# Altium project TP2_vchesnea.PrjPcb
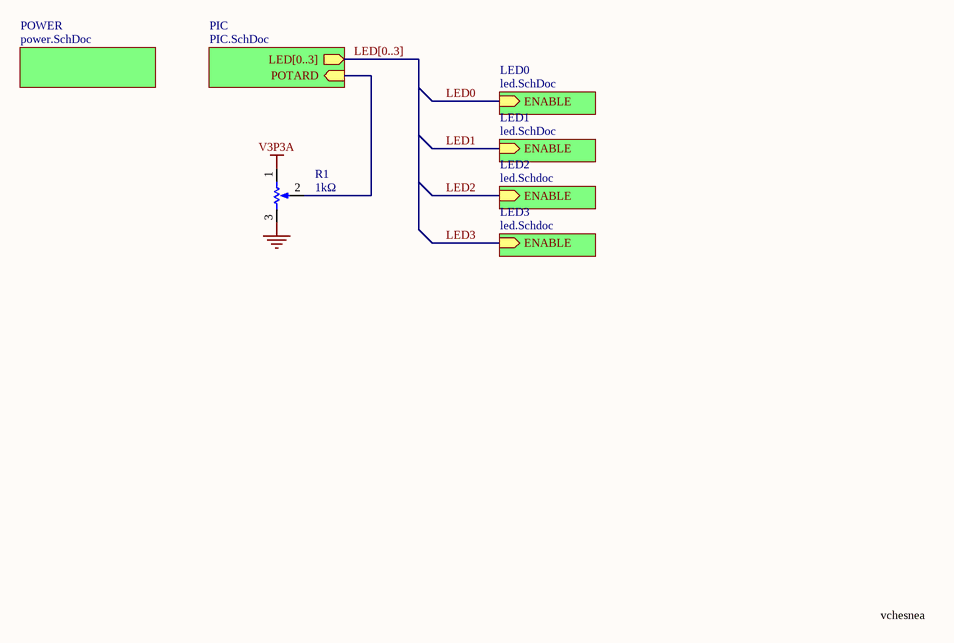
[diagram p0: TP2.SchDoc]
4 sheets, 36 parts. Net scope: hierarchical (ports join the sheet entries above them; power ports are global).
Sheets:
  TP2.SchDoc
    POWER = power.SchDoc
    PIC = PIC.SchDoc
    LED0 = led.SchDoc
    LED1 = led.SchDoc
    LED2 = led.SchDoc
    LED3 = led.SchDoc

## Sheet TP2.SchDoc
size A4

### Parts
R1  1kΩ  [PDB181-K415K-102A2]

### Sub-sheets
LED0 = led.SchDoc: ENABLE (in)
LED1 = led.SchDoc: ENABLE (in)
LED2 = led.Schdoc: ENABLE (in)
LED3 = led.Schdoc: ENABLE (in)
PIC = PIC.SchDoc: POTARD (in), LED[0..3] (out)
POWER = power.SchDoc: no entries

### Nets
+12: R1.3(TOP)
V3P3A: R1.1(BOT)
NetR1_2: R1.2(TAP) ; sheet PIC/POTARD

### Buses and harness runs
bus LED[0..3] = sheet PIC/LED[0..3]

### Notes on the sheet
- vchesnea
- Title
- Size:
- Date:
- A4
- Number:
- Time:
- Revision:
- Sheet
- of
- File:

### Library data of the parts
R1 = RPot: Potentiometer; Sim Note: Enter the Resistance value and the set point into parameter fields.; Set Position: 0.5; Value: 1K; Fournisseur: Farnell; Fabricant: BOURNS; RefFournisseur: 1823540; Published: 8-Jun-2000; LatestRevisionDate: 17-Jul-2002; LatestRevisionNote: Re-released for DXP Platform.; PackageReference: VR5; Publisher: Altium Limited; PackageDescription: Variable Resistor, Thru-Hole; 3 Leads; RefFabricant: PDB181-K415K-102A2

## Sheet power.SchDoc
size A4
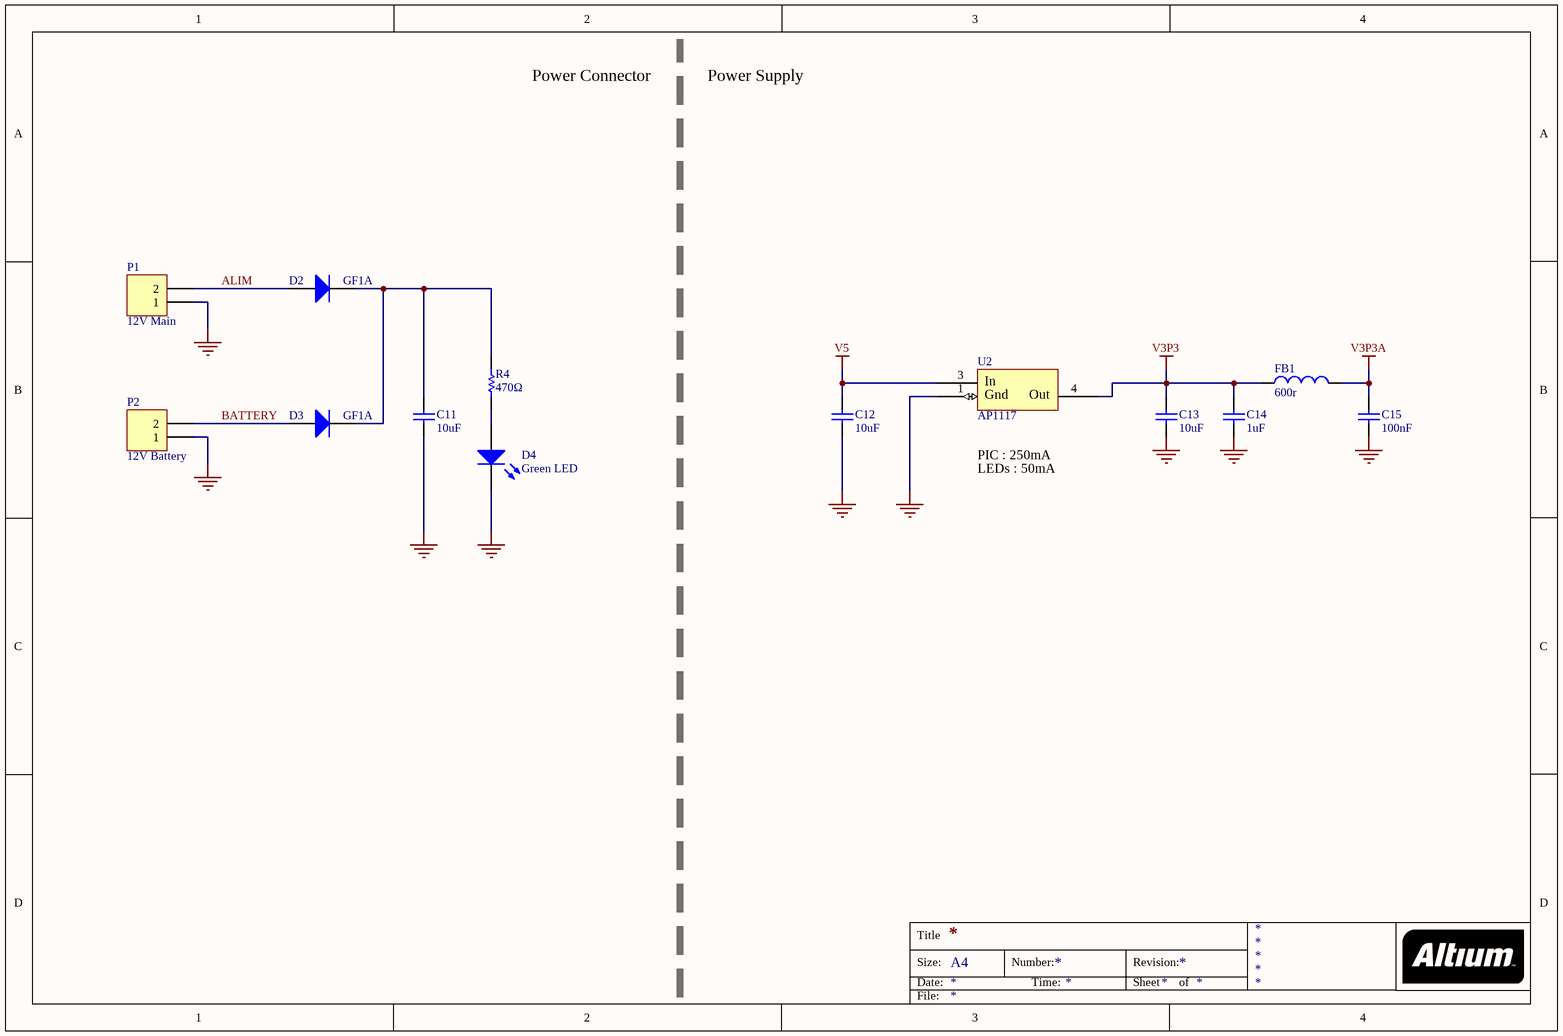
[diagram p1: power.SchDoc]

### Parts
C11  10uF  [CAPC2012N]
C12  10uF  [CAPC2012N]
C13  10uF  [CAPC2012N]
C14  1uF  [CAPC1608N]
C15  100nF  [CAPC1608N]
D2  GF1A  [SMA/DO-214AC_21]
D3  GF1A  [SMA/DO-214AC_21]
D4  Green LED  [LED 0805]
FB1  600r  [INDC1608AN]
P1  12V Main  [PHOENIX_1985195]
P2  12V Battery  [PHOENIX_1985195]
R4  470Ω  [RESC1608N]
U2  AP1117  [TD03B_N]

### Nets
GND: C11.1 C12.1 C13.1 C14.1 C15.1 D4.2(K) P1.1 P2.1 U2.1
V3P3: C13.2 C14.2 FB1.1 U2.4
V3P3A: C15.2 FB1.2
V5: C12.2 U2.3
ALIM: D2.1(A) P1.2
BATTERY: D3.1(A) P2.2
NetC11_2: C11.2 D2.2(K) D3.2(K) R4.2
NetD4_1: D4.1(A) R4.1

### Notes on the sheet
- Power Connector
- Power Supply
- (near U2) PIC : 250mA
- LEDs : 50mA
- Title
- Size:
- Date:
- A4
- Number:
- Time:
- Revision:
- Sheet
- of
- File:
- (in symbol AP1117) In; Gnd; Out

### Library data of the parts
C11 C12 = Cap: Capacitor; Value: 100pF; Fabricant: TDK; Fournisseur: Farnell; RefFabricant: C2012X5R0J106M/1.25; RefFournisseur: 2309029; Precision: 6.3V X5R; Published: 8-Jun-2000; LatestRevisionDate: 17-Jul-2002; LatestRevisionNote: Re-released for DXP Platform.; PackageReference: RAD-0.3; Publisher: Altium Limited; PackageDescription: Radial Cap, Thru-Hole; 2 Leads; 0.3 in Pin Spacing
C13 = Cap: Capacitor; Value: 100pF; Precision: 6.3V X5R; Published: 8-Jun-2000; LatestRevisionDate: 17-Jul-2002; LatestRevisionNote: Re-released for DXP Platform.; PackageReference: RAD-0.3; Publisher: Altium Limited; PackageDescription: Radial Cap, Thru-Hole; 2 Leads; 0.3 in Pin Spacing
C14 = Cap: Capacitor; Value: 100pF; Precision: 6.2V X5R; Published: 8-Jun-2000; LatestRevisionDate: 17-Jul-2002; LatestRevisionNote: Re-released for DXP Platform.; PackageReference: RAD-0.3; Publisher: Altium Limited; PackageDescription: Radial Cap, Thru-Hole; 2 Leads; 0.3 in Pin Spacing
C15 = Cap: Capacitor; Value: 100pF; Precision: 50V X5R; Published: 8-Jun-2000; LatestRevisionDate: 17-Jul-2002; LatestRevisionNote: Re-released for DXP Platform.; PackageReference: RAD-0.3; Publisher: Altium Limited; PackageDescription: Radial Cap, Thru-Hole; 2 Leads; 0.3 in Pin Spacing
D2 = Diode: Default Diode; RefFournisseur: 1792769; Published: 8-Jun-2000; LatestRevisionDate: 17-Jul-2002; LatestRevisionNote: Re-released for DXP Platform.; PackageVersion: Sep-1996; PackageReference: SMC; Publisher: Altium Limited; PackageDescription: DO-214-AB/SMC; 2 C-Bend Leads; Body 7.9 x 5.9 mm, inc. leads (LxW); Code_JEDEC: DO-214-AB
D3 = Diode: Default Diode; Published: 8-Jun-2000; LatestRevisionDate: 17-Jul-2002; LatestRevisionNote: Re-released for DXP Platform.; PackageVersion: Sep-1996; PackageReference: SMC; Publisher: Altium Limited; PackageDescription: DO-214-AB/SMC; 2 C-Bend Leads; Body 7.9 x 5.9 mm, inc. leads (LxW); Code_JEDEC: DO-214-AB
D4 = LED0: Typical INFRARED GaAs LED; Fabricant: KINGBRIGHT; Fournisseur: Farnell; RefFabricant: KPT-2012SGC; RefFournisseur: 2099239; Published: 8-Jun-2000; LatestRevisionDate: 08-Jul-2005; LatestRevisionNote: Mech Layer 1 removed.; PackageReference: LED-0; Publisher: Altium Limited; PackageDescription: LED; 2 Leads
FB1 = Inductor: Code_IEC: 1005; Value: 10mH; Fabricant: Wurth; Fournisseur: Farnell; RefFabricant: 742792651; RefFournisseur: 1635706; Published: 8-Jun-2000; LatestRevisionDate: 29-May-2009; LatestRevisionNote: IPC-7351 Footprint Added.; PackageReference: 0402-A; Publisher: Altium Limited; PackageDescription: Chip Inductor; Code_JEITA: 0402
P1 P2 = Header 2: Header, 2-Pin; LatestRevisionDate: 17-Jul-2002; LatestRevisionNote: Re-released for DXP Platform.; Publisher: Altium Limited
R4 = Res1: Resistor; Value: 1K; Precision: 1%; Published: 8-Jun-2000; LatestRevisionDate: 17-Jul-2002; LatestRevisionNote: Re-released for DXP Platform.; PackageReference: AXIAL-0.3; Publisher: Altium Limited; PackageDescription: Axial Device, Thru-Hole; 2 Leads; 0.3 in Pin Spacing
U2 = AP1117: 1A LDO, 18V input, DPAK; Fabricant: DIODES INC; Fournisseur: Farnell; RefFournisseur: 1825285; RefFabricant: AP1117D3G-13

## Sheet PIC.SchDoc
size A4
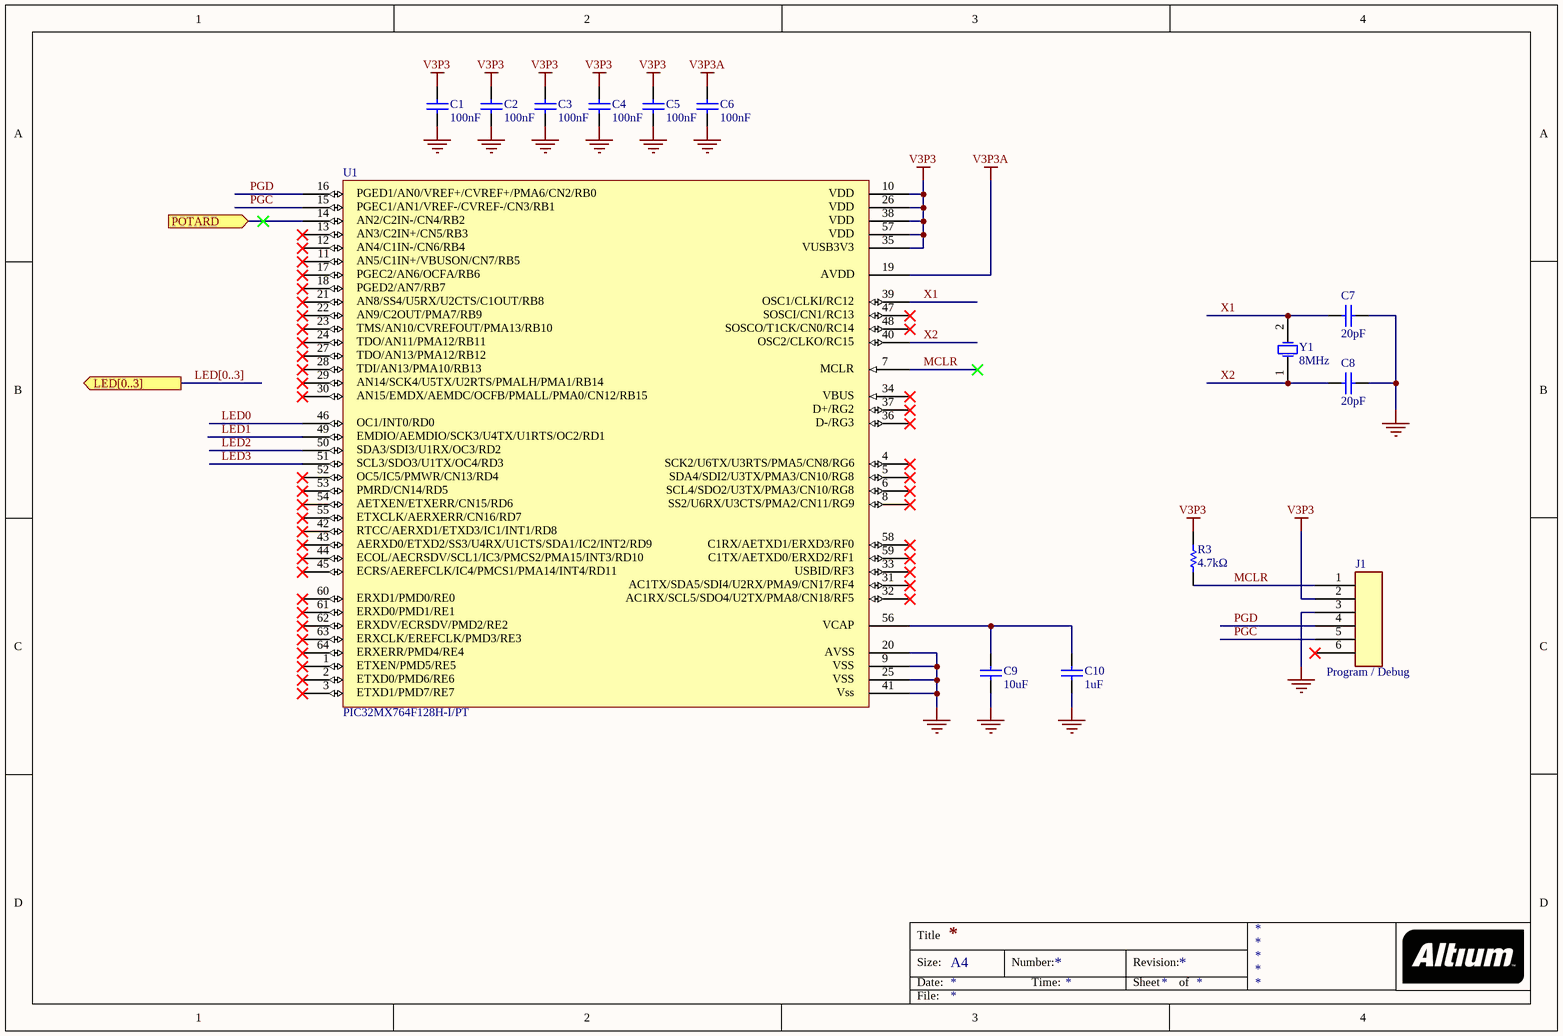
[diagram p2: PIC.SchDoc]

### Parts
C1  100nF  [CAPC1608N]
C2  100nF  [CAPC1608N]
C3  100nF  [CAPC1608N]
C4  100nF  [CAPC1608N]
C5  100nF  [CAPC1608N]
C6  100nF  [CAPC1608N]
C7  20pF  [CAPC1005N]
C8  20pF  [CAPC1005N]
C9  10uF  [CAPC2012N]
C10  1uF  [CAPC1608N]
J1  Program / Debug
R3  4.7kΩ  [RESC1608N]
U1  PIC32MX764F128H-I/PT
Y1  8MHz  [PCBComponent_1]

### Ports
LED[0..3] (out), POTARD (in)

### Nets
GND: C1.1 C2.1 C3.1 C4.1 C5.1 C6.1 C7.2 C8.2 C9.1 C10.1 J1.3 U1.9 U1.20 U1.25 U1.41
V3P3: C1.2 C2.2 C3.2 C4.2 C5.2 J1.2 R3.2 U1.10 U1.26 U1.35 U1.38 U1.57
V3P3A: C6.2 U1.19
LED0: U1.46
LED1: U1.49
LED2: U1.50
LED3: U1.51
MCLR: J1.1 R3.1 U1.7
PGC: J1.5 U1.15
PGD: J1.4 U1.16
X1: C7.1 U1.39 Y1.2(OSC2)
X2: C8.1 U1.40 Y1.1(OSC1)
NetC9_2: C9.2 C10.2 U1.56
NetR1_2: U1.14 ; port POTARD

Not connected (* = marked no-connect by the designer): J1 6*; U1 1* 2* 3* 4* 5* 6* 8* 11* 12* 13* 17* 18* 21* 22* 23* 24* 27* 28* 29* 30* 31* 32* 33* 34* 36* 37* 42* 43* 44* 45* 47* 48* 52* 53* 54* 55* 58* 59* 60* 61* 62* 63* 64*

### Buses and harness runs
bus LED[0..3] = port LED[0..3]

### Notes on the sheet
- Title
- Size:
- Date:
- A4
- Number:
- Time:
- Revision:
- Sheet
- of
- File:
- (in symbol PIC32MX764F128H-I/PT) PGED1/AN0/VREF+/CVREF+/PMA6/CN2/RB0; VDD; PGEC1/AN1/VREF-/CVREF-/CN3/RB1; AN2/C2IN-/CN4/RB2; AN3/C2IN+/CN5/RB3; AN4/C1IN-/CN6/RB4; VUSB3V3; AN5/C1IN+/VBUSON/CN7/RB5; PGEC2/AN6/OCFA/RB6; AVDD; PGED2/AN7/RB7; AN8/SS4/U5RX/U2CTS/C1OUT/RB8; OSC1/CLKI/RC12; AN9/C2OUT/PMA7/RB9; SOSCI/CN1/RC13; TMS/AN10/CVREFOUT/PMA13/RB10; SOSCO/T1CK/CN0/RC14; TDO/AN11/PMA12/RB11; OSC2/CLKO/RC15; TDO/AN13/PMA12/RB12; TDI/AN13/PMA10/RB13; MCLR; AN14/SCK4/U5TX/U2RTS/PMALH/PMA1/RB14; AN15/EMDX/AEMDC/OCFB/PMALL/PMA0/CN12/RB15; VBUS; D+/RG2; OC1/INT0/RD0; D-/RG3; EMDIO/AEMDIO/SCK3/U4TX/U1RTS/OC2/RD1; SDA3/SDI3/U1RX/OC3/RD2; SCL3/SDO3/U1TX/OC4/RD3; SCK2/U6TX/U3RTS/PMA5/CN8/RG6; OC5/IC5/PMWR/CN13/RD4; SDA4/SDI2/U3TX/PMA3/CN10/RG8; PMRD/CN14/RD5; SCL4/SDO2/U3TX/PMA3/CN10/RG8; AETXEN/ETXERR/CN15/RD6; SS2/U6RX/U3CTS/PMA2/CN11/RG9; ETXCLK/AERXERR/CN16/RD7; RTCC/AERXD1/ETXD3/IC1/INT1/RD8; AERXD0/ETXD2/SS3/U4RX/U1CTS/SDA1/IC2/INT2/RD9; C1RX/AETXD1/ERXD3/RF0; ECOL/AECRSDV/SCL1/IC3/PMCS2/PMA15/INT3/RD10; C1TX/AETXD0/ERXD2/RF1; ECRS/AEREFCLK/IC4/PMCS1/PMA14/INT4/RD11; USBID/RF3; AC1TX/SDA5/SDI4/U2RX/PMA9/CN17/RF4; ERXD1/PMD0/RE0; AC1RX/SCL5/SDO4/U2TX/PMA8/CN18/RF5; ERXD0/PMD1/RE1; ERXDV/ECRSDV/PMD2/RE2; VCAP; ERXCLK/EREFCLK/PMD3/RE3; ERXERR/PMD4/RE4; AVSS; ETXEN/PMD5/RE5; VSS; ETXD0/PMD6/RE6; ETXD1/PMD7/RE7; Vss

### Library data of the parts
C1-C8 = Cap: Capacitor; Value: 100pF; Fournisseur: Farnell; Published: 8-Jun-2000; LatestRevisionDate: 17-Jul-2002; LatestRevisionNote: Re-released for DXP Platform.; PackageReference: RAD-0.3; Publisher: Altium Limited; PackageDescription: Radial Cap, Thru-Hole; 2 Leads; 0.3 in Pin Spacing
C9 C10 = Cap: Capacitor; Fournisseur: Farnell; Published: 8-Jun-2000; LatestRevisionDate: 17-Jul-2002; LatestRevisionNote: Re-released for DXP Platform.; PackageReference: RAD-0.3; Publisher: Altium Limited; PackageDescription: Radial Cap, Thru-Hole; 2 Leads; 0.3 in Pin Spacing
  C9: Value: 10uF
  C10: Value: 1uF
J1 = CON6: Fabricant: Molex; Fournisseur: Farnell; RefFabricant: 53398-0671; RefFournisseur: 1125368; Footprint: MOLEX 6P 1.25 CMS
R3 = Res1: Resistor; Value: 1K; Published: 8-Jun-2000; LatestRevisionDate: 17-Jul-2002; LatestRevisionNote: Re-released for DXP Platform.; PackageReference: AXIAL-0.3; Publisher: Altium Limited; PackageDescription: Axial Device, Thru-Hole; 2 Leads; 0.3 in Pin Spacing
U1 = PIC32MX764F128H-I/PT: PIC32MX764F128H; Fabricant: Microchip; Fournisseur: Farnell; RefFournisseur: 1971889; Footprint: QFP50P1200X1200X120-64; RefFabricant: PIC32MX764F128H-I/PT
Y1 = XTAL: Crystal Oscillator; Fabricant: FOX ELECTRONICS; Fournisseur: Farnell; RefFournisseur: 2063972; RefFabricant: FOXSDLF/080-20; Published: 8-Jun-2000; LatestRevisionDate: 17-Jul-2002; LatestRevisionNote: Re-released for DXP Platform.; PackageReference: R38; Publisher: Altium Limited; PackageDescription: Crystal, Thru-Hole; 2 Leads; Body 3.1 x 8.2 mm (Dia.xH); Footprint: XTAL139X50X45

## Sheet led.SchDoc
size A4
Used 4 times, as channels LED0, LED1, LED2, LED3. Parts and nets are listed once, with the designators drawn on the sheet.
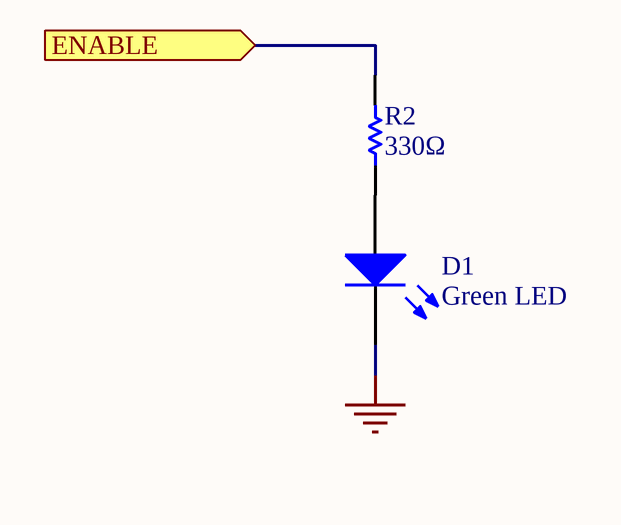
[diagram p3: led.SchDoc]

### Parts
D1  Green LED  [LED 0805]
R2  330Ω  [RESC1608N]

### Ports
ENABLE (in)

### Nets
GND: D1.2(K)
ENABLE: R2.2 ; port ENABLE
NetD1_1: D1.1(A) R2.1

### Channels
LED0: designators end in _LED0; ports ENABLE=LED0
LED1: designators end in _LED1; ports ENABLE=LED1
LED2: designators end in _LED2; ports ENABLE=LED2
LED3: designators end in _LED3; ports ENABLE=LED3

### Notes on the sheet
- Title
- Size:
- Date:
- A4
- Number:
- Time:
- Revision:
- Sheet
- of
- File:

### Library data of the parts
D1 = LED0: as D4 on sheet power; Published: 8-Jun-2000; LatestRevisionDate: 08-Jul-2005; LatestRevisionNote: Mech Layer 1 removed.; PackageReference: LED-0; Publisher: Altium Limited; PackageDescription: LED; 2 Leads
R2 = Res1: Resistor; Value: 1K; Precision: 1%; Published: 8-Jun-2000; LatestRevisionDate: 17-Jul-2002; LatestRevisionNote: Re-released for DXP Platform.; PackageReference: AXIAL-0.3; Publisher: Altium Limited; PackageDescription: Axial Device, Thru-Hole; 2 Leads; 0.3 in Pin Spacing; RefFabricant: *

## Nets that join several sheets
GND: power (9 pins), PIC (15 pins), LED0 (D1_LED0.2), LED1 (D1_LED1.2), LED2 (D1_LED2.2), LED3 (D1_LED3.2)
V3P3: power (C13.2 C14.2 FB1.1 U2.4), PIC (12 pins)
V3P3A: TP2 (R1.1), power (C15.2 FB1.2), PIC (C6.2 U1.19)
LED0: PIC (U1.46), LED0 (R2_LED0.2)
LED1: PIC (U1.49), LED1 (R2_LED1.2)
LED2: PIC (U1.50), LED2 (R2_LED2.2)
LED3: PIC (U1.51), LED3 (R2_LED3.2)
NetR1_2: TP2 (R1.2), PIC (U1.14)